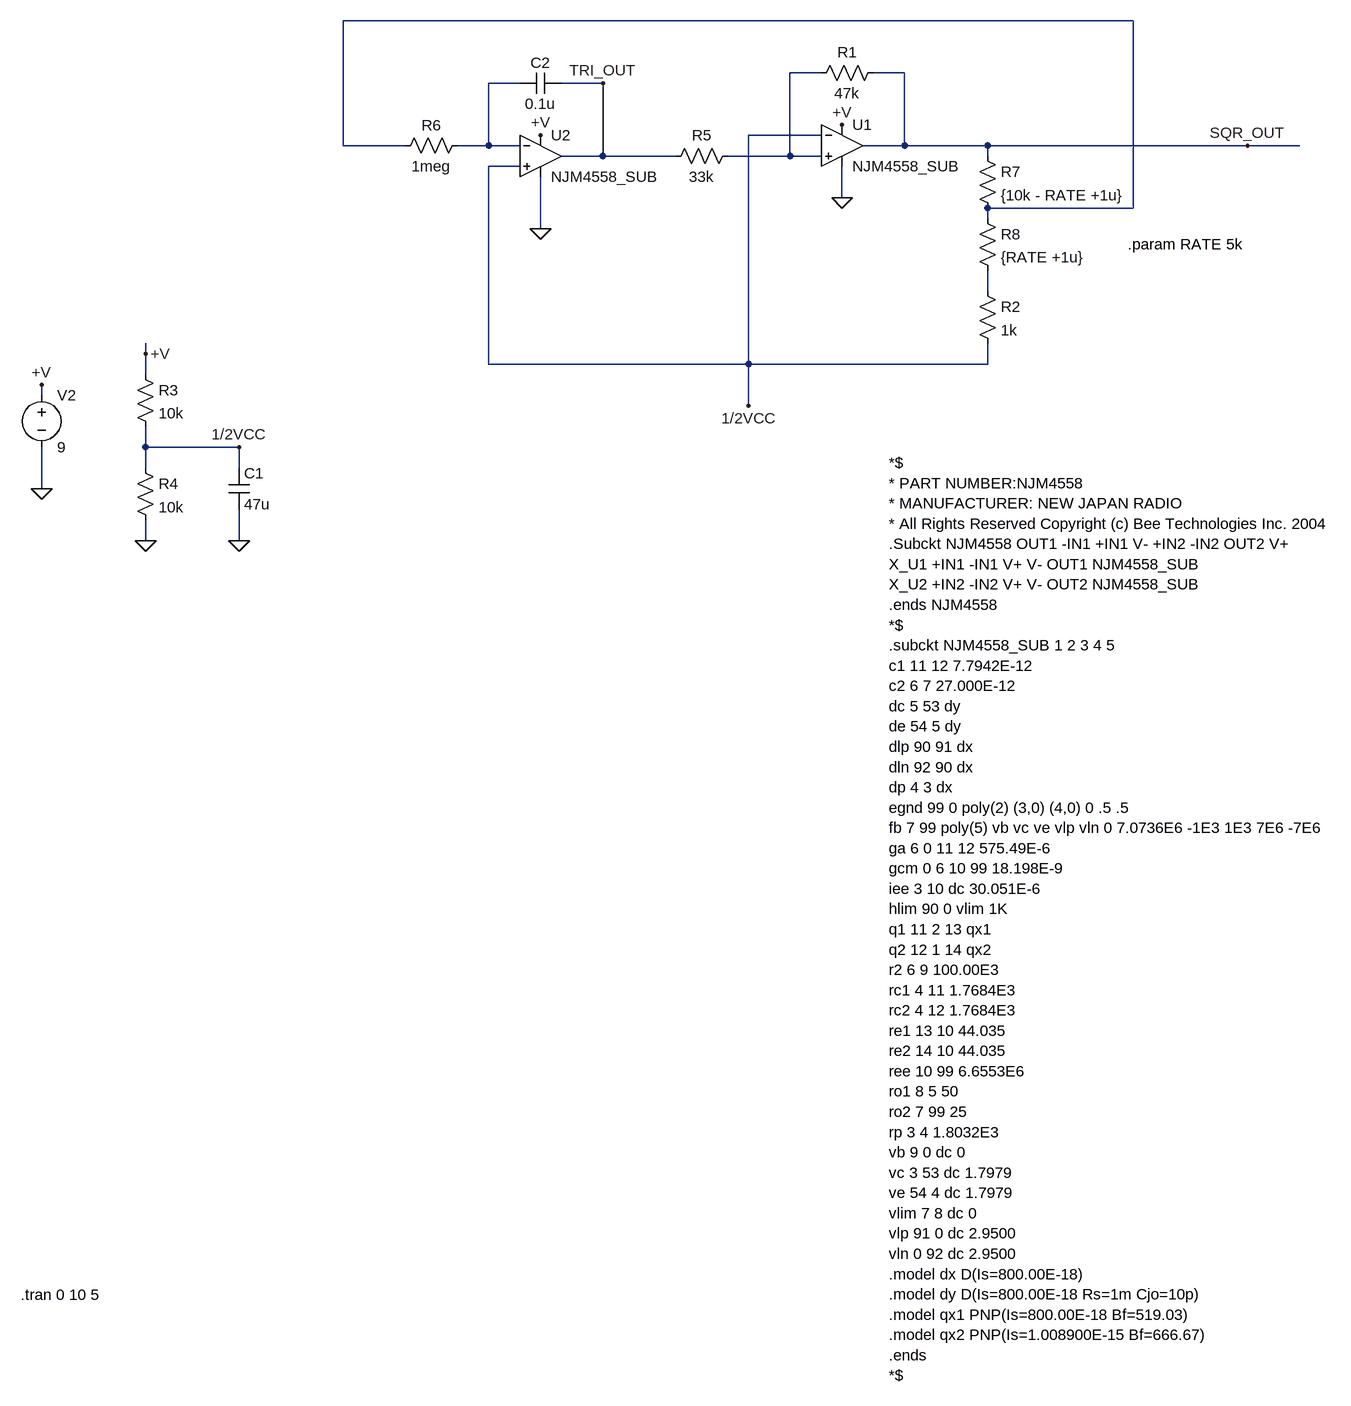
[diagram p0: schematic LFO.asc]
LFO.asc, the LTspice schematic file:
Version 4
SHEET 1 1256 2056
WIRE 816 80 -400 80
WIRE 336 160 288 160
WIRE 464 160 416 160
WIRE -128 176 -176 176
WIRE 0 176 -64 176
WIRE 336 256 224 256
WIRE -400 272 -400 80
WIRE -304 272 -400 272
WIRE -176 272 -176 176
WIRE -176 272 -224 272
WIRE -128 272 -176 272
WIRE 464 272 464 160
WIRE 464 272 400 272
WIRE 592 272 464 272
WIRE 992 272 592 272
WIRE 1072 272 992 272
WIRE 0 288 0 176
WIRE 0 288 -64 288
WIRE 112 288 0 288
WIRE 288 288 288 160
WIRE 288 288 192 288
WIRE 336 288 288 288
WIRE 592 288 592 272
WIRE -128 304 -176 304
WIRE 368 352 368 304
WIRE 816 368 816 80
WIRE 816 368 592 368
WIRE 592 384 592 368
WIRE -96 400 -96 320
WIRE 592 496 592 464
WIRE -704 592 -704 576
WIRE -176 608 -176 304
WIRE 224 608 224 256
WIRE 224 608 -176 608
WIRE 592 608 592 576
WIRE 592 608 224 608
WIRE -704 624 -704 592
WIRE -864 656 -864 640
WIRE 224 672 224 608
WIRE -704 736 -704 704
WIRE -560 736 -704 736
WIRE -704 768 -704 736
WIRE -560 768 -560 736
WIRE -864 800 -864 736
WIRE -704 880 -704 848
WIRE -560 880 -560 832
FLAG -864 800 0
FLAG -864 640 +V
FLAG 368 240 +V
FLAG 368 352 0
FLAG -704 880 0
FLAG -560 880 0
FLAG -704 592 +V
FLAG -560 736 1/2VCC
FLAG -96 256 +V
FLAG -96 400 0
FLAG 224 672 1/2VCC
FLAG 992 272 SQR_OUT
FLAG 0 176 TRI_OUT
SYMBOL Opamps\\opamp2 368 208 R0
SYMATTR InstName U1
SYMATTR Value NJM4558_SUB
SYMBOL voltage -864 640 R0
WINDOW 123 0 0 Left 2
WINDOW 39 0 0 Left 2
SYMATTR InstName V2
SYMATTR Value 9
SYMBOL res 432 144 R90
WINDOW 0 0 56 VBottom 2
WINDOW 3 32 56 VTop 2
SYMATTR InstName R1
SYMATTR Value 47k
SYMBOL cap -576 768 R0
SYMATTR InstName C1
SYMATTR Value 47u
SYMBOL res -720 608 R0
SYMATTR InstName R3
SYMATTR Value 10k
SYMBOL res -720 752 R0
SYMATTR InstName R4
SYMATTR Value 10k
SYMBOL Opamps\\opamp2 -96 224 R0
SYMATTR InstName U2
SYMATTR Value NJM4558_SUB
SYMBOL res 208 272 R90
WINDOW 0 0 56 VBottom 2
WINDOW 3 32 56 VTop 2
SYMATTR InstName R5
SYMATTR Value 33k
SYMBOL res -208 256 R90
WINDOW 0 0 56 VBottom 2
WINDOW 3 32 56 VTop 2
SYMATTR InstName R6
SYMATTR Value 1meg
SYMBOL res 576 272 R0
SYMATTR InstName R7
SYMATTR Value {10k - RATE +1u}
SYMBOL res 576 368 R0
SYMATTR InstName R8
SYMATTR Value {RATE +1u}
SYMBOL cap -64 160 R90
WINDOW 0 0 32 VBottom 2
WINDOW 3 32 32 VTop 2
SYMATTR InstName C2
SYMATTR Value 0.1u
SYMBOL res 576 480 R0
SYMATTR InstName R2
SYMATTR Value 1k
TEXT 440 760 Left 2 !*$\n* PART NUMBER:NJM4558\n* MANUFACTURER: NEW JAPAN RADIO\n* All Rights Reserved Copyright (c) Bee Technologies Inc. 2004\n.Subckt NJM4558 OUT1 -IN1 +IN1 V- +IN2 -IN2 OUT2 V+\nX_U1 +IN1 -IN1 V+ V- OUT1 NJM4558_SUB\nX_U2 +IN2 -IN2 V+ V- OUT2 NJM4558_SUB\n.ends NJM4558\n*$\n.subckt NJM4558_SUB 1 2 3 4 5\nc1 11 12 7.7942E-12\nc2 6 7 27.000E-12\ndc 5 53 dy\nde 54 5 dy\ndlp 90 91 dx\ndln 92 90 dx\ndp 4 3 dx\negnd 99 0 poly(2) (3,0) (4,0) 0 .5 .5\nfb 7 99 poly(5) vb vc ve vlp vln 0 7.0736E6 -1E3 1E3 7E6 -7E6\nga 6 0 11 12 575.49E-6\ngcm 0 6 10 99 18.198E-9\niee 3 10 dc 30.051E-6\nhlim 90 0 vlim 1K\nq1 11 2 13 qx1\nq2 12 1 14 qx2\nr2 6 9 100.00E3\nrc1 4 11 1.7684E3\nrc2 4 12 1.7684E3\nre1 13 10 44.035\nre2 14 10 44.035\nree 10 99 6.6553E6\nro1 8 5 50\nro2 7 99 25\nrp 3 4 1.8032E3\nvb 9 0 dc 0\nvc 3 53 dc 1.7979\nve 54 4 dc 1.7979\nvlim 7 8 dc 0\nvlp 91 0 dc 2.9500\nvln 0 92 dc 2.9500\n.model dx D(Is=800.00E-18)\n.model dy D(Is=800.00E-18 Rs=1m Cjo=10p)\n.model qx1 PNP(Is=800.00E-18 Bf=519.03)\n.model qx2 PNP(Is=1.008900E-15 Bf=666.67)\n.ends\n*$
TEXT 808 424 Left 2 !.param RATE 5k
TEXT -896 2040 Left 2 !.tran 0 10 5

The netlist it stands for:
* LFO.asc
XU1 N002 1/2VCC +V 0 SQR_OUT NJM4558_SUB  ; pins In+ In- V+ V- OUT
V2 +V 0 9
R1 SQR_OUT N002 47k
C1 1/2VCC 0 47u
R3 +V 1/2VCC 10k
R4 1/2VCC 0 10k
XU2 1/2VCC N003 +V 0 TRI_OUT NJM4558_SUB  ; pins In+ In- V+ V- OUT
R5 N002 TRI_OUT 33k
R6 N003 N001 1meg
R7 SQR_OUT N001 {10k - RATE +1u}
R8 N001 N004 {RATE +1u}
C2 TRI_OUT N003 0.1u
R2 N004 1/2VCC 1k
*$
* PART NUMBER:NJM4558
* MANUFACTURER: NEW JAPAN RADIO
* All Rights Reserved Copyright (c) Bee Technologies Inc. 2004
.Subckt NJM4558 OUT1 -IN1 +IN1 V- +IN2 -IN2 OUT2 V+
X_U1 +IN1 -IN1 V+ V- OUT1 NJM4558_SUB
X_U2 +IN2 -IN2 V+ V- OUT2 NJM4558_SUB
.ends NJM4558
*$
.subckt NJM4558_SUB 1 2 3 4 5
c1 11 12 7.7942E-12
c2 6 7 27.000E-12
dc 5 53 dy
de 54 5 dy
dlp 90 91 dx
dln 92 90 dx
dp 4 3 dx
egnd 99 0 poly(2) (3,0) (4,0) 0 .5 .5
fb 7 99 poly(5) vb vc ve vlp vln 0 7.0736E6 -1E3 1E3 7E6 -7E6
ga 6 0 11 12 575.49E-6
gcm 0 6 10 99 18.198E-9
iee 3 10 dc 30.051E-6
hlim 90 0 vlim 1K
q1 11 2 13 qx1
q2 12 1 14 qx2
r2 6 9 100.00E3
rc1 4 11 1.7684E3
rc2 4 12 1.7684E3
re1 13 10 44.035
re2 14 10 44.035
ree 10 99 6.6553E6
ro1 8 5 50
ro2 7 99 25
rp 3 4 1.8032E3
vb 9 0 dc 0
vc 3 53 dc 1.7979
ve 54 4 dc 1.7979
vlim 7 8 dc 0
vlp 91 0 dc 2.9500
vln 0 92 dc 2.9500
.model dx D(Is=800.00E-18)
.model dy D(Is=800.00E-18 Rs=1m Cjo=10p)
.model qx1 PNP(Is=800.00E-18 Bf=519.03)
.model qx2 PNP(Is=1.008900E-15 Bf=666.67)
.ends
*$
.param RATE 5k
.tran 0 10 5
.backanno
.end